# Altium schematic sheet 5_1_attenuators.SchDoc: RF Attenuators
size A4; OrganizationName: Pluton UPV; Address1: Universitat Politècnica; Address2: de València (UPV); Address3: Camí de Vera, València; Address4: Spain; SheetNumber: 7; SheetTotal: 12
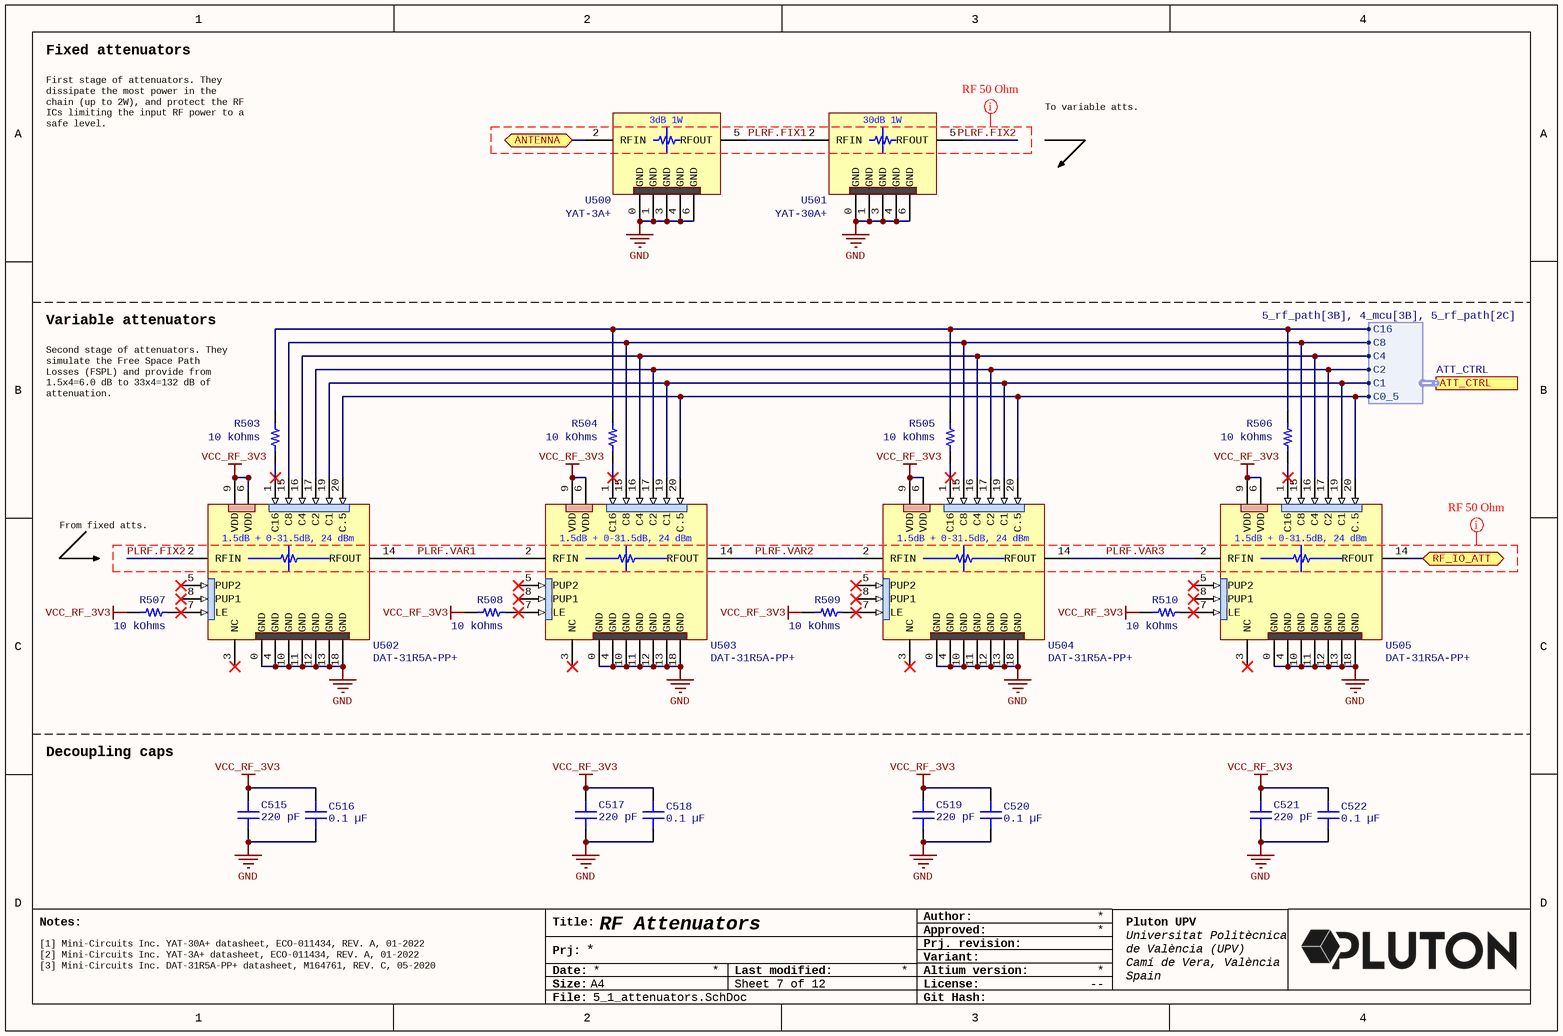
[diagram p0: 5_1_attenuators.SchDoc]

## Parts
C515  220 pF  [CAP 0201_0603]
C516  0.1 µF  [CAP 0402_1005]
C517  220 pF  [CAP 0201_0603]
C518  0.1 µF  [CAP 0402_1005]
C519  220 pF  [CAP 0201_0603]
C520  0.1 µF  [CAP 0402_1005]
C521  220 pF  [CAP 0201_0603]
C522  0.1 µF  [CAP 0402_1005]
R503  10 kOhms  [RES 0201_0603]
R504  10 kOhms  [RES 0201_0603]
R505  10 kOhms  [RES 0201_0603]
R506  10 kOhms  [RES 0201_0603]
R507  10 kOhms  [RES 0201_0603]
R508  10 kOhms  [RES 0201_0603]
R509  10 kOhms  [RES 0201_0603]
R510  10 kOhms  [RES 0201_0603]
U500  YAT-3A+  [MC1630]
U501  YAT-30A+  [MC1630]
U502  DAT-31R5A-PP+  [DG983-2]
U503  DAT-31R5A-PP+  [DG983-2]
U504  DAT-31R5A-PP+  [DG983-2]
U505  DAT-31R5A-PP+  [DG983-2]

## Ports
ANTENNA (bidir, see 5_rf_path[3B]), ATT_CTRL (harness ATT_CTRL, see 5_rf_path[3B], 4_mcu[3B], 5_rf_path[2C]), RF_IO_ATT (bidir, see 5_rf_path[3B], 5_2_switches[3B])

## Harnesses
ATT_CTRL: C16, C8, C4, C2, C1, C0_5

## Nets
GND: C515.1 C516.1 C517.1 C518.1 C519.1 C520.1 C521.1 C522.1 U500.0(GND) U500.1(GND) U500.3(GND) U500.4(GND) U500.6(GND) U501.0(GND) U501.1(GND) U501.3(GND) U501.4(GND) U501.6(GND) U502.0(GND) U502.4(GND) U502.10(GND) U502.11(GND) U502.12(GND) U502.13(GND) U502.18(GND) U503.0(GND) U503.4(GND) U503.10(GND) U503.11(GND) U503.12(GND) U503.13(GND) U503.18(GND) U504.0(GND) U504.4(GND) U504.10(GND) U504.11(GND) U504.12(GND) U504.13(GND) U504.18(GND) U505.0(GND) U505.4(GND) U505.10(GND) U505.11(GND) U505.12(GND) U505.13(GND) U505.18(GND)
VCC_RF_3V3: C515.2 C516.2 C517.2 C518.2 C519.2 C520.2 C521.2 C522.2 R507.2 R508.2 R509.2 R510.2 U502.6(VDD) U502.9(VDD) U503.6(VDD) U503.9(VDD) U504.6(VDD) U504.9(VDD) U505.6(VDD) U505.9(VDD)
ANTENNA: U500.2(RFIN) ; port ANTENNA
PLRF.FIX1: U500.5(RFOUT) U501.2(RFIN)
PLRF.FIX2: U501.5(RFOUT) U502.2(RFIN)
PLRF.VAR1: U502.14(RFOUT) U503.2(RFIN)
PLRF.VAR2: U503.14(RFOUT) U504.2(RFIN)
PLRF.VAR3: U504.14(RFOUT) U505.2(RFIN)
RF_IO_ATT: U505.14(RFOUT) ; port RF_IO_ATT
NetR503_1: R503.1 R504.1 R505.1 R506.1 ; port ATT_CTRL.C16
NetR503_2: R503.2 U502.1(C16)
NetR504_2: R504.2 U503.1(C16)
NetR505_2: R505.2 U504.1(C16)
NetR506_2: R506.2 U505.1(C16)
NetR507_1: R507.1 U502.7(LE)
NetR508_1: R508.1 U503.7(LE)
NetR509_1: R509.1 U504.7(LE)
NetR510_1: R510.1 U505.7(LE)
NetU502_15: U502.15(C8) U503.15(C8) U504.15(C8) U505.15(C8) ; port ATT_CTRL.C8
NetU502_16: U502.16(C4) U503.16(C4) U504.16(C4) U505.16(C4) ; port ATT_CTRL.C4
NetU502_17: U502.17(C2) U503.17(C2) U504.17(C2) U505.17(C2) ; port ATT_CTRL.C2
NetU502_19: U502.19(C1) U503.19(C1) U504.19(C1) U505.19(C1) ; port ATT_CTRL.C1
NetU502_20: U502.20(C.5) U503.20(C.5) U504.20(C.5) U505.20(C.5) ; port ATT_CTRL.C0_5

Not connected (* = marked no-connect by the designer): U502 3(NC)* 5(PUP2)* 8(PUP1)*; U503 3(NC)* 5(PUP2)* 8(PUP1)*; U504 3(NC)* 5(PUP2)* 8(PUP1)*; U505 3(NC)* 5(PUP2)* 8(PUP1)*

## Layout directives
net class RF50; rule Width Constraint [Pref Impedance = 50.00ohms    Min Impedance = 50.00ohms    Max Impedance = 50.00ohms]: PLRF.FIX1, PLRF.FIX2, PLRF.VAR1, PLRF.VAR2, PLRF.VAR3

## Notes on the sheet
- Fixed attenuators
- To variable atts.
- First stage of attenuators. They dissipate the most power in the chain (up to 2W), and protect the RF ICs limiting the input RF power to a safe level.
- Variable attenuators
- (near R503) Second stage of attenuators. They simulate the Free Space Path Losses (FSPL) and provide from 1.5x4=6.0 dB to 33x4=132 dB of attenuation.
- (near U502) From fixed atts.
- Decoupling caps
- [1] Mini-Circuits Inc. YAT-30A+ datasheet, ECO-011434, REV. A, 01-2022
  [2] Mini-Circuits Inc. YAT-3A+ datasheet, ECO-011434, REV. A, 01-2022
  [3] Mini-Circuits Inc. DAT-31R5A-PP+ datasheet, M164761, REV. C, 05-2020
- Notes:
- Title:
- Author:
- Approved:
- Date:
- Prj:
- Size:
- A4
- Last modified:
- Altium version:
- Variant:
- Prj. revision:
- License:
- --
- File:
- Git Hash:
- (in symbol DAT-31R5A-PP+) 1.5dB + 0-31.5dB, 24 dBm
- (in symbol YAT-3A) 3dB 1W
- (in symbol YAT-30A) 30dB 1W

## Library data of the parts
C515 C517 C519 C521 = GRM0335C1H221JA01D: CAP CER 220PF 50V C0G/NP0 0201; manufacturer: Murata Electronics; Temperature Coefficient: C0G, NP0; Tolerance: ±5%; Part Number: GRM0335C1H221JA01D; Value: 220 pF; Applications: General Purpose; Capacitance: 220 pF; componentlink1description: Datasheet; componentlink1url: https://search.murata.co.jp/Ceramy/image/img/A01X/G101/ENG/GRM0335C1H221JA01-01.pdf; componentlink2description: DigiKey Link; componentlink2url: https://www.digikey.com/en/products/detail/murata-electronics/GRM0335C1H221JA01D/4904370; Device Package: 0201 (0603 Metric); lastupdated: 04/06/2024 19:01:09; Lifecycle Status: Active; Minimum Order: 1; Mounting Type: Surface Mount; Operating Temperature: -55°C ~ 125°C; Package / Case: 0201 (0603 Metric); packaging: CutTape; partid: 574; Part Status: Active; price: 0.01; series: GRM; Size / Dimension: 0.024" L x 0.012" W (0.60mm x 0.30mm); Supplier 1: DigiKey; Supplier Part Number 1: 490-11316-1-ND; Thickness (Max): 0.013" (0.33mm); Voltage - Rated: 50V
C516 C518 C520 C522 = C0402C104K4RECAUTO: CAP CER 0402 0.1UF 16V X7R 10%; manufacturer: KEMET; Part Number: C0402C104K4RECAUTO; Value: 0.1 µF; Applications: Automotive, ESD Protection; Capacitance: 0.1 µF; componentlink1description: Datasheet; componentlink1url: https://api.kemet.com/component-edge/download/datasheet/C0402C104K4RECAUTO.pdf; componentlink2description: DigiKey Link; componentlink2url: https://www.digikey.com/en/products/detail/kemet/C0402C104K4RECAUTO/8563695; Device Package: 0402 (1005 Metric); lastupdated: 09/02/2024 20:04:38; Lifecycle Status: Active; Minimum Order: 1; Mounting Type: Surface Mount, MLCC; Operating Temperature: -55°C ~ 125°C; Package / Case: 0402 (1005 Metric); packaging: TapeAndReel; partid: 1731; Part Status: Active; price: 0.01; Ratings: AEC-Q200; series: ESD SMD Auto X7R; Size / Dimension: 0.039" L x 0.020" W (1.00mm x 0.50mm); Supplier 1: DigiKey; Supplier Part Number 1: 399-17167-1-ND; Temperature Coefficient: X7R; Thickness (Max): 0.022" (0.55mm); Tolerance: ±10%; Voltage - Rated: 16V
R503-R510 = AF0201FR-0710KL: RES SMD 10K OHM 1% 1/20W 0201; Manufacturer: Yageo; Power (Watts): 0.05W, 1/20W; Temperature Coefficient: ±200ppm/°C; Part Number: AF0201FR-0710KL; Value: 10 kOhms; ComponentLink1Description: Datasheet; ComponentLink1URL: https://www.yageo.com/upload/media/product/productsearch/datasheet/rchip/PYu-AF_51_RoHS_L_9.pdf; ComponentLink2Description: DigiKey Link; ComponentLink2URL: https://www.digikey.com/en/products/detail/yageo/AF0201FR-0710KL/5900138; Composition: Thick Film; Device Package: 0201 (0603 Metric); Features: Anti-Sulfur, Automotive AEC-Q200; Height - Seated (Max): 0.010" (0.26mm); LastUpdated: 04/06/2024 19:11:47; Lifecycle Status: Active; Minimum Order: 1; Number of Terminations: 2; Operating Temperature: -55°C ~ 125°C; Package / Case: 0201 (0603 Metric); Packaging: TapeAndReel; PartId: 78061; Part Status: Active; Price: 0.01; Ratings: AEC-Q200; Resistance: 10 kOhms; Series: AF; Size / Dimension: 0.024" L x 0.012" W (0.60mm x 0.30mm); Supplier 1: DigiKey; Supplier Part Number 1: 13-AF0201FR-0710KLCT-ND; Supplier Device Package: 0201; Tolerance: ±1%
U500 = YAT-3A: Fixed Attenuator 50 OHM 2W 3 dB DC to 18 GHz
U501 = YAT-30A: Fixed Attenuator 50 OHM 1W 30 dB DC to 18 GHz
U502-U505 = DAT-31R5A-PP+: Digital Step Attenuator  50Ω 0 to 31.5 dB, 0.5 dB Step DC to 4.0 GHz parallel